# Altium schematic sheet 1-POWER.SchDoc: RD15002_SingleSCT.PrjPcb
size A4; DrawnBy: 邓勇杰; Revision: A1.0.0; SheetNumber: 2; SheetTotal: 10; Time: 2015/12/2
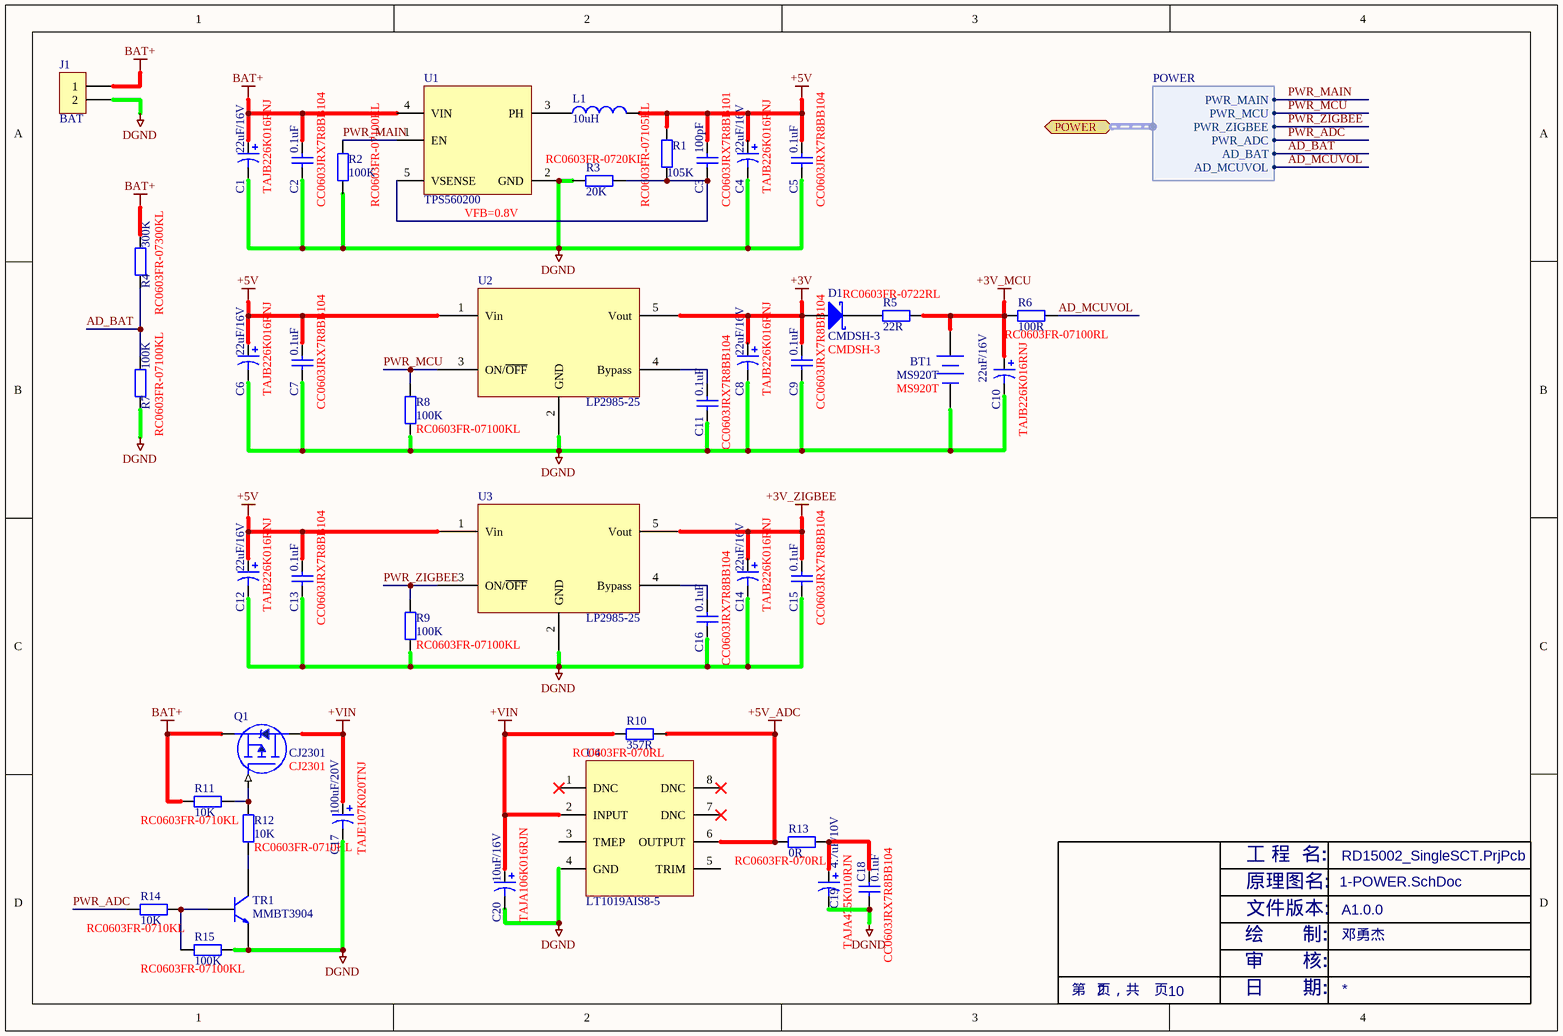
[diagram p0: 1-POWER.SchDoc]

## Parts
BT1  MS920T  [MS920T]
C1  22uF/16V  Part No.: TAJB226K016RNJ  [CB3528]
C2  0.1uF  Type No.: CC0603JRX7R8BB104  [CC0603]
C3  100pF  Type No.: CC0603JRX7R8BB101  [CC0603]
C4  22uF/16V  Part No.: TAJB226K016RNJ  [CB3528]
C5  0.1uF  Type No.: CC0603JRX7R8BB104  [CC0603]
C6  22uF/16V  Part No.: TAJB226K016RNJ  [CB3528]
C7  0.1uF  Type No.: CC0603JRX7R8BB104  [CC0603]
C8  22uF/16V  Part No.: TAJB226K016RNJ  [CB3528]
C9  0.1uF  Type No.: CC0603JRX7R8BB104  [CC0603]
C10  22uF/16V  Part No.: TAJB226K016RNJ  [CB3528]
C11  0.1uF  Type No.: CC0603JRX7R8BB104  [CC0603]
C12  22uF/16V  Part No.: TAJB226K016RNJ  [CB3528]
C13  0.1uF  Type No.: CC0603JRX7R8BB104  [CC0603]
C14  22uF/16V  Part No.: TAJB226K016RNJ  [CB3528]
C15  0.1uF  Type No.: CC0603JRX7R8BB104  [CC0603]
C16  0.1uF  Type No.: CC0603JRX7R8BB104  [CC0603]
C17  100uF/20V  Type No.: TAJE107K020TNJ  [CD7343]
C18  0.1uF  Type No.: CC0603JRX7R8BB104  [CC0603]
C19  4.7uF/10V  Type No.: TAJA475K010RJN  [CA3216]
C20  10uF/16V  Type No.: TAJA106K016RJN  [CA3216]
D1  CMDSH-3  [SOD323]
J1  BAT  [CON2-2.54MM]
L1  10uH  [SLF6025]
Q1  CJ2301  [SOT-23W]
R1  105K  Type No.: RC0603FR-07105KL  [CC0603]
R2  100K  Type No.: RC0603FR-07100KL  [CC0603]
R3  20K  Type No.: RC0603FR-0720KL  [CC0603]
R4  300K  Type No.: RC0603FR-07300KL  [CC0603]
R5  22R  Type No.: RC0603FR-0722RL  [CC0603]
R6  100R  Type No.: RC0603FR-07100RL  [CC0603]
R7  100K  Type No.: RC0603FR-07100KL  [CC0603]
R8  100K  Type No.: RC0603FR-07100KL  [CC0603]
R9  100K  Type No.: RC0603FR-07100KL  [CC0603]
R10  357R  Type No.: RC0603FR-070RL  [CC0603]
R11  10K  Type No.: RC0603FR-0710KL  [CC0603]
R12  10K  Type No.: RC0603FR-0710KL  [CC0603]
R13  0R  Type No.: RC0603FR-070RL  [CC0603]
R14  10K  Type No.: RC0603FR-0710KL  [CC0603]
R15  100K  Type No.: RC0603FR-07100KL  [CC0603]
TR1  MMBT3904  [SOT-23W]
U1  TPS560200  [SOT-23-5]
U2  LP2985-25  [SOT-23-5]
U3  LP2985-25  [SOT-23-5]
U4  LT1019AIS8-5  [SO-8]

## Ports
POWER (harness POWER)

## Harnesses
POWER: AD_BAT, PWR_MAIN, PWR_MCU, PWR_ZIGBEE, PWR_ADC, AD_MCUVOL

## Nets
+3V: C8.1 C9.2 D1.1(A) U2.5(Vout)
+3V_MCU: BT1.1(+) C10.1 R5.1 R6.2
+3V_ZIGBEE: C14.1 C15.2 U3.5(Vout)
+5V: C3.2 C4.1 C5.2 C6.1 C7.2 C12.1 C13.2 L1.2 R1.1 U2.1(Vin) U3.1(Vin)
+5V_ADC: R10.1 R13.2 U4.6(OUTPUT)
+VIN: C17.1 C20.1 Q1.3(DRAIN) R10.2 U4.2(INPUT)
BAT+: C1.1 C2.2 J1.1 Q1.2(SOURCE) R4.1 R11.2 U1.4(VIN)
DGND: BT1.2(-) C1.2 C2.1 C4.2 C5.1 C6.2 C7.1 C8.2 C9.1 C10.2 C11.1 C12.2 C13.1 C14.2 C15.1 C16.1 C17.2 C18.1 C19.2 C20.2 J1.2 R2.2 R3.2 R7.2 R8.2 R9.2 R15.1 TR1.2 U1.2(GND) U2.2(GND) U3.2(GND) U4.4(GND)
AD_BAT: R4.2 R7.1 ; port POWER.AD_BAT
AD_MCUVOL: R6.1 ; port POWER.AD_MCUVOL
PWR_ADC: R14.2 ; port POWER.PWR_ADC
PWR_MAIN: R2.1 U1.1(EN) ; port POWER.PWR_MAIN
PWR_MCU: R8.1 U2.3(ON/~{OFF}) ; port POWER.PWR_MCU
PWR_ZIGBEE: R9.1 U3.3(ON/~{OFF}) ; port POWER.PWR_ZIGBEE
NetC3_1: C3.1 R1.2 R3.1 U1.5(VSENSE)
NetC11_2: C11.2 U2.4(Bypass)
NetC16_2: C16.2 U3.4(Bypass)
NetC18_2: C18.2 C19.1 R13.1
NetD1_2: D1.2(K) R5.2
NetL1_1: L1.1 U1.3(PH)
NetQ1_1: Q1.1(GATE) R11.1 R12.1
NetR12_2: R12.2 TR1.3
NetR14_1: R14.1 R15.2 TR1.1

Not connected (* = marked no-connect by the designer): U4 1(DNC)* 3(TMEP) 5(TRIM) 7(DNC)* 8(DNC)*

## Notes on the sheet
- (near U1) VFB=0.8V
- 文件版本:
- 原理图名:
- 工 程  名:
- 绘       制:
- 审       核:
- 第   页，共    页
- 日       期:

## Library data of the parts
BT1 = Battery: Multicell Battery; Type No.: MS920T
C1 C4 C6 C8 C10 C12 C14 C19 C20 = Cap Pol1: Polarized Capacitor (Radial)
C2 C3 C5 C7 C9 C11 C13 C15 C16 C18 = Cap: Capacitor
C17 = Cap Pol3: Polarized Capacitor (Surface Mount)
D1 = D Schottky: Schottky Diode; Type No.: CMDSH-3
J1 = SIP2: jointbar
L1 = Inductor: Code_IEC: 1005; Value: 10mH; Published: 8-Jun-2000; LatestRevisionDate: 29-May-2009; LatestRevisionNote: IPC-7351 Footprint Added.; PackageReference: 0402-A; Publisher: Altium Limited; PackageDescription: Chip Inductor; Code_JEITA: 0402
Q1 = P-MOSFET1: Type No.: CJ2301
R1-R15 = Res2: Resistor
TR1 = NPN
U2 U3 = LP2985